# EAGLE schematic 구조도 (EAGLE 9.7.0)
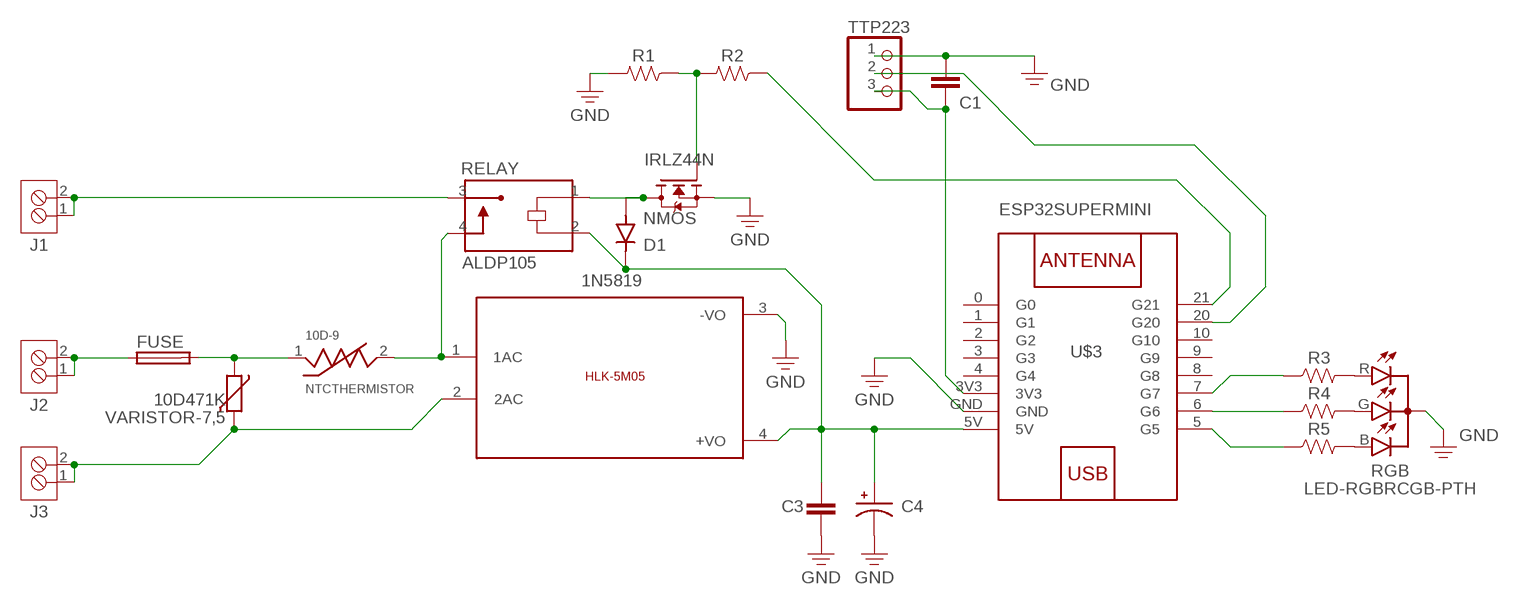
[diagram p0: schematic, sheet 1]

## Parts
10D471K  VARISTOR-7,5  [R-7,5]
10D-9  NTCTHERMISTOR  [NTCTHERMISTOR]
C1  CAPACITORCERAMIC-2.54MM  [CAP-THRU-2.54MM]
C3  CAPACITORCERAMIC-2.54MM  [CAP-THRU-2.54MM]
C4  EEUFC0J101  [CAPPRD200W50D500H1100]
D1  1N5819  [DIOAD1036W78L470D235]
FUSE  GSH15  [GSH15]
J1  2828XX-2282837-2  [TERMBLK_508-2N]
J2  2828XX-2282837-2  [TERMBLK_508-2N]
J3  2828XX-2282837-2  [TERMBLK_508-2N]
NMOS  IRLZ44N  [TO254P1054X469X1930-3]
R1  R-US_AXIAL-7.2MM-PITCH  [RESAD724W46L381D178B]
R2  R-US_AXIAL-7.2MM-PITCH  [RESAD724W46L381D178B]
R3  R-US_AXIAL-7.2MM-PITCH  [RESAD724W46L381D178B]
R4  R-US_AXIAL-7.2MM-PITCH  [RESAD724W46L381D178B]
R5  R-US_AXIAL-7.2MM-PITCH  [RESAD724W46L381D178B]
RELAY  ALDP105  [RELAY_ALDP105]
RGB  LED-RGBRCGB-PTH  [LED-RGB-RCGB-5MM]
TTP223  PINHD-1X3  [1X03]
U$1  5VDC/5W  HLK-5M05  [HLK-5M05]
U$3  ESP32SUPERMINI  [ESP32SUPERMINI_ESP32-SUPERMINI]

## Nets
GND: C1.1 C3.2 C4.N NMOS.3(S) R1.2 RGB.C TTP223.1 U$1.3(-VO) U$3.GND
N$2: FUSE.1 J2.1 J2.2
N$3: D1.A NMOS.2(D) RELAY.1(COIL1)
N$4: C1.2 TTP223.3 U$3.3V3
N$5: J1.1 J1.2 RELAY.3(COM)
N$7: TTP223.2 U$3.20(G20)
N$8: NMOS.1(G) R1.1 R2.2
N$9: R4.2 RGB.G
N$10: R3.1 U$3.7(G7)
N$11: R3.2 RGB.R
N$12: R5.2 RGB.B
N$13: C3.1 C4.P D1.C(K) RELAY.2(COIL2) U$1.4(+VO) U$3.5V
N$14: R2.1 U$3.21(G21)
N$15: 10D471K.2 J3.1 J3.2 U$1.2(2AC)
N$16: 10D-9.2 RELAY.4(NO) U$1.1(1AC)
N$17: R4.1 U$3.6(G6)
N$18: R5.1 U$3.5(G5)
N$19: 10D471K.1 10D-9.1 FUSE.2
Unconnected: U$3.0(G0) U$3.1(G1) U$3.2(G2) U$3.3(G3) U$3.4(G4) U$3.8(G8) U$3.9(G9) U$3.10(G10)

## Library data of the parts
10D471K = varistor:VARISTOR: VARISTOR
10D-9 = B57237S0100M000:NTCTHERMISTOR: Check availability <https://pricing.snapeda.com/parts/B57237S0100M000/EPCOS/view-part?ref=eda>
C1 C3 = Tinkercad:CAPACITOR: Capacitor - Generic
C4 = EEUFC0J101:EEUFC0J101: Check availability <https://pricing.snapeda.com/parts/EEUFC0J101/Panasonic/view-part?ref=eda>
D1 = 1N5819:1N5819: Check availability <https://pricing.snapeda.com/parts/1N5819/Taiwan%20Semiconductor/view-part?ref=eda>
FUSE = fuses:GSH15: FUSE HOLDER grid 15mm, 19649 Wickmann
J1-J3 = Connector:2828XX-2: 2 Position Wire to Board Terminal Block Horizontal with Board Reference: Datasheet <https://www.te.com.cn/commerce/DocumentDelivery/DDEController?Action=showdoc&DocId=Catalog+Section%7F1308389_EUROSTYLE_TERMINAL_BLOCKS%7F0607%7Fpdf%7FEnglish%7FENG_CS_1308389_EUROSTYLE_TERMINAL_BLOCKS_0607.pdf%7F2-282837-5>
NMOS = IRLZ44N:IRLZ44N: Check availability <https://pricing.snapeda.com/parts/IRLZ44N/Infineon%20Technologies/view-part?ref=eda>
R1-R5 = Resistor:R-US: Resistor Fixed - ANSI
RELAY = ALDP105:ALDP105: Check availability <https://pricing.snapeda.com/parts/ALDP105/Panasonic/view-part?ref=eda>
RGB = rgb:LED-RGB
TTP223 = pinhead:PINHD-1X3: PIN HEADER
U$1 = HLK-5M05:HLK-5M05: HLK-5M05 is an 5Volt/5W smps developed by HI-LINK
U$3 = ESP32C3supermini:ESP32SUPERMINI: WEMOS D1 mini: Mini Wi-Fi Board based on ESP-8266 device More details can be found here: https://www.wemos.cc/product/d1-mini.html Click here to find device on ebay.com <http://www.ebay.com/sch/wemos+d1+mini+nodemcu>